# Altium schematic sheet 单片机局部电路.SchDoc
size A4; Time: 22/04/18
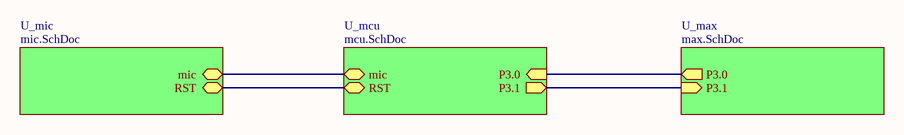
[diagram p0: 单片机局部电路.SchDoc]

## Sub-sheets
U_max = max.SchDoc: P3.1 (in), P3.0 (out)
U_mcu = mcu.SchDoc: RST (bidir), mic (bidir), P3.0 (in), P3.1 (out)
U_mic = mic.SchDoc: mic (bidir), RST (bidir)

## Nets
(unnamed): sheet U_mic/mic, sheet U_mcu/mic
(unnamed): sheet U_mic/RST, sheet U_mcu/RST
(unnamed): sheet U_mcu/P3.0, sheet U_max/P3.0
(unnamed): sheet U_mcu/P3.1, sheet U_max/P3.1

## Notes on the sheet
- 专升本
- 通信工程
- 李烨攀
- 2101班
- 210806300163
- 学号